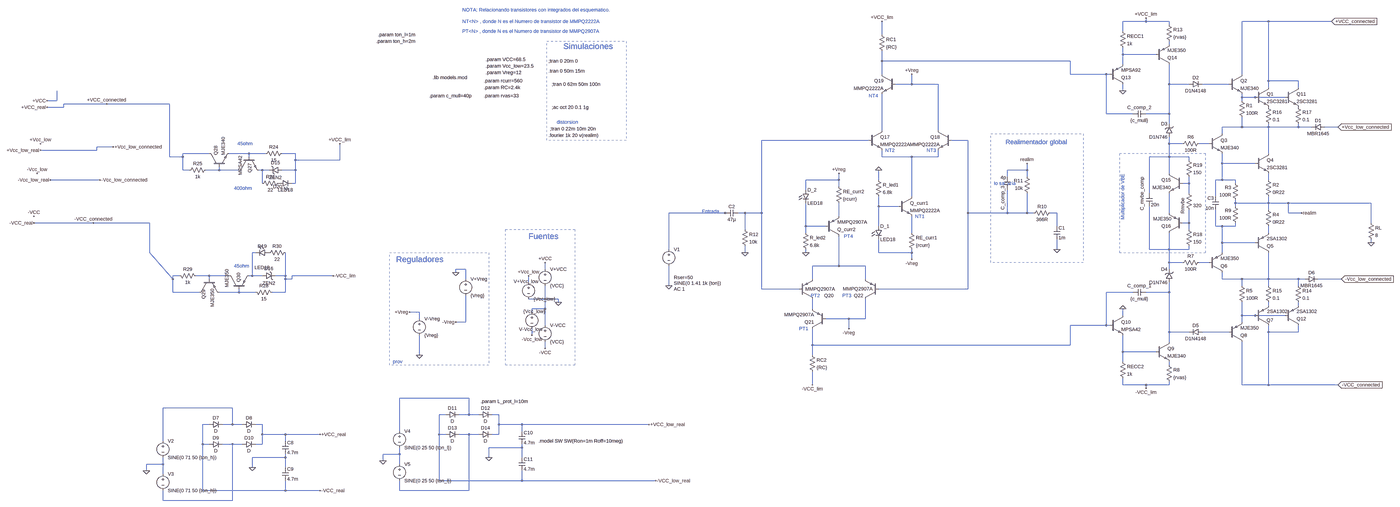
[diagram p0: schematic ampli-exp.asc, whole sheet]
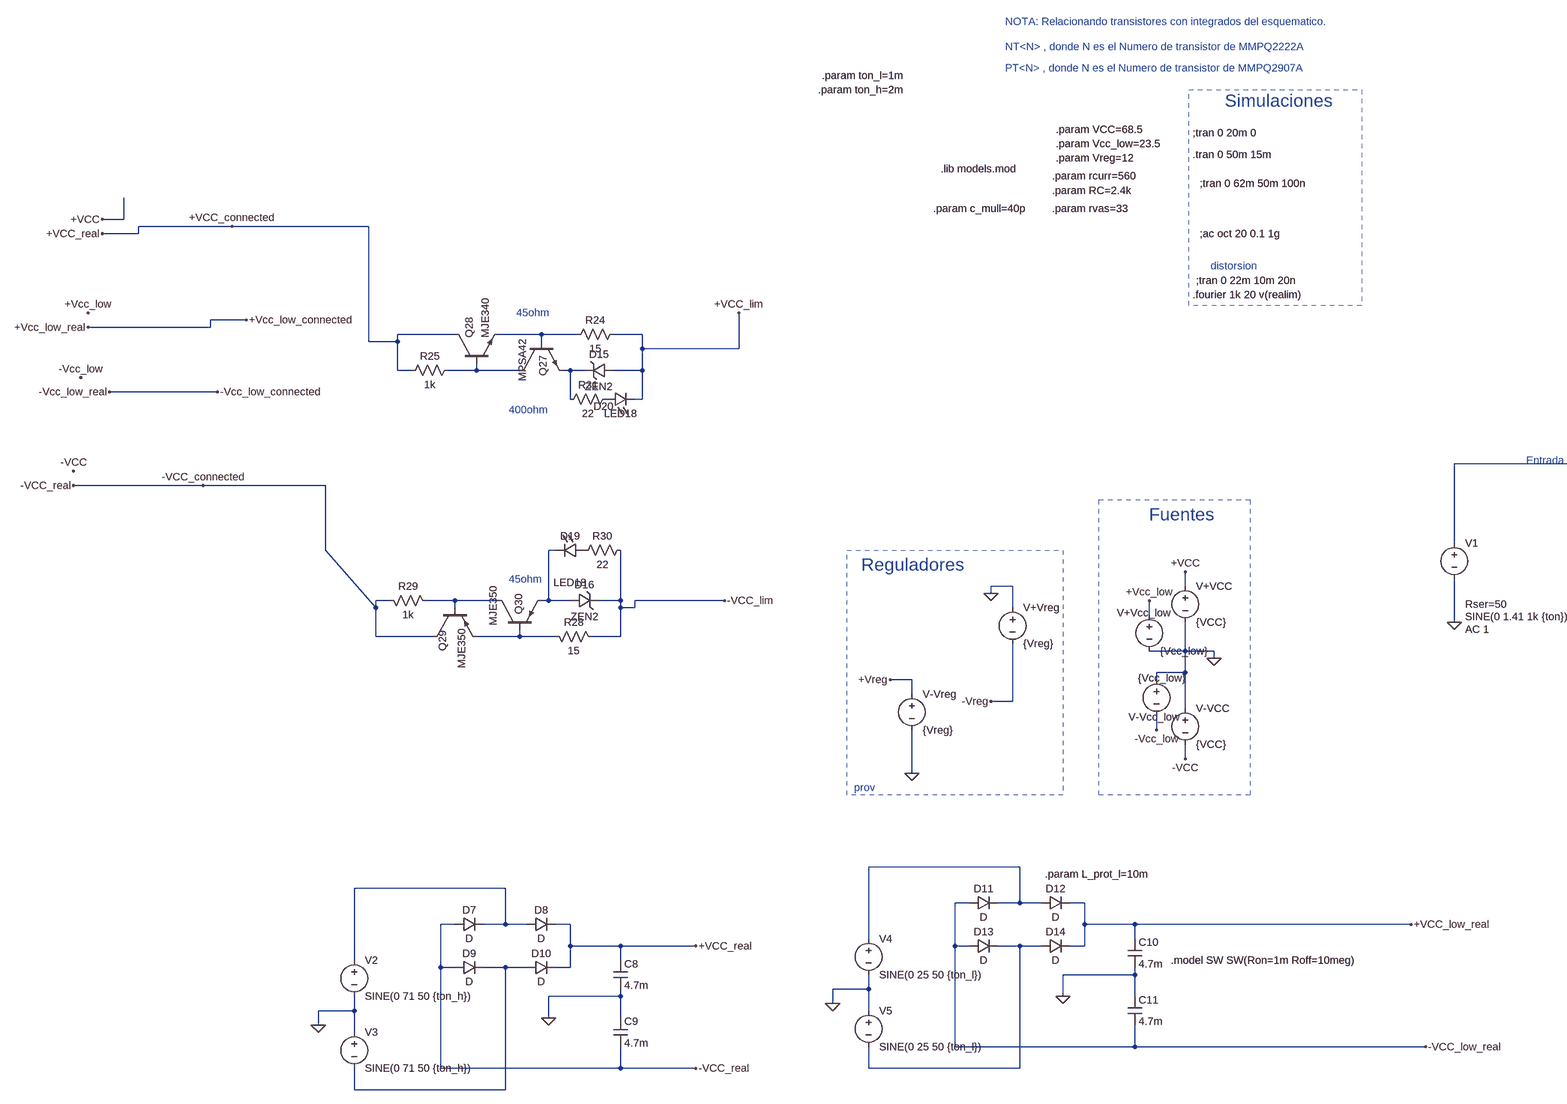
[diagram p1: schematic ampli-exp.asc, part, row 1 of 1, column 1 of 2]
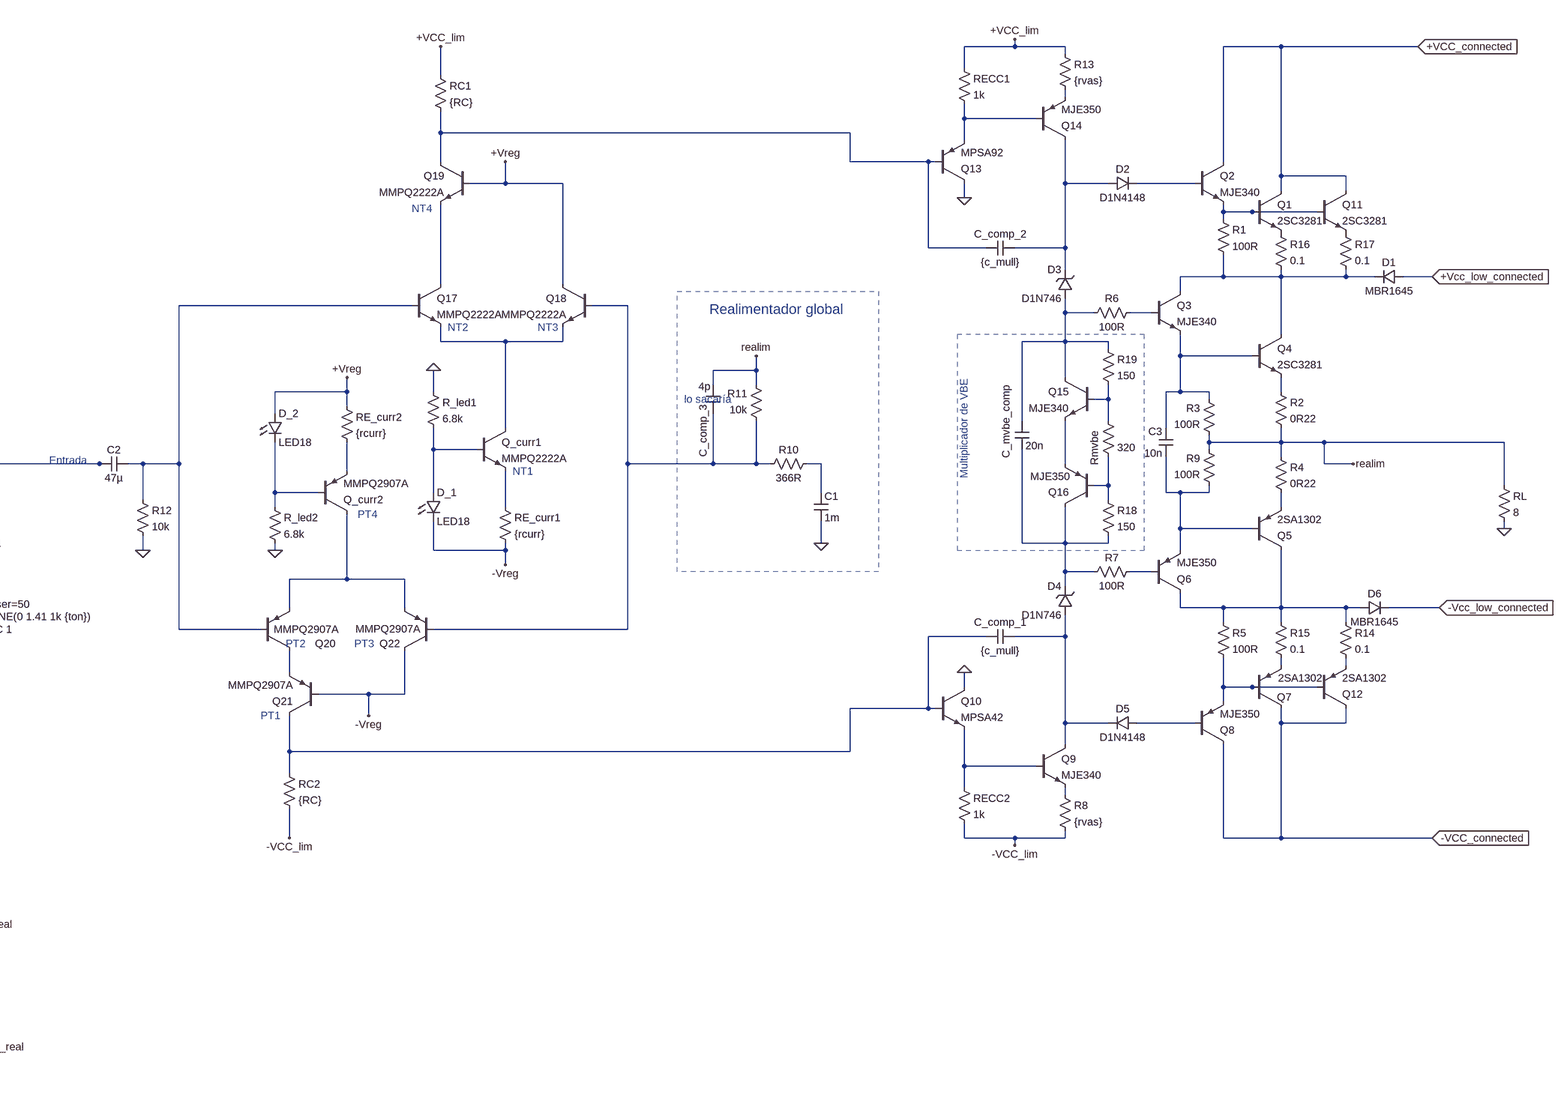
[diagram p2: schematic ampli-exp.asc, part, row 1 of 1, column 2 of 2]
ampli-exp.asc, the LTspice schematic file:
Version 4
SHEET 1 6132 2164
WIRE 1792 -752 1792 -768
WIRE 1792 -752 1680 -752
WIRE 1904 -752 1792 -752
WIRE 2384 -752 2256 -752
WIRE 2688 -752 2384 -752
WIRE 1904 -736 1904 -752
WIRE 1680 -704 1680 -752
WIRE 464 -688 464 -752
WIRE 1904 -640 1904 -656
WIRE 1680 -592 1680 -624
WIRE 1840 -592 1680 -592
WIRE 464 -560 464 -608
WIRE 1392 -560 464 -560
WIRE 1680 -544 1680 -592
WIRE 464 -496 464 -560
WIRE 1392 -496 1392 -560
WIRE 1600 -496 1392 -496
WIRE 1616 -496 1600 -496
WIRE 2256 -496 2256 -752
WIRE 2384 -464 2384 -752
WIRE 2528 -464 2384 -464
WIRE 608 -448 608 -496
WIRE 608 -448 528 -448
WIRE 736 -448 608 -448
WIRE 1904 -448 1904 -544
WIRE 2000 -448 1904 -448
WIRE 2192 -448 2064 -448
WIRE 2384 -432 2384 -464
WIRE 2528 -432 2528 -464
WIRE 1680 -416 1680 -448
WIRE 2256 -384 2256 -400
WIRE 2320 -384 2256 -384
WIRE 2464 -384 2320 -384
WIRE -3600 -368 -3600 -416
WIRE -3600 -368 -3648 -368
WIRE 2256 -368 2256 -384
WIRE -3360 -352 -3568 -352
WIRE -3056 -352 -3360 -352
WIRE -3568 -336 -3568 -352
WIRE -3568 -336 -3648 -336
WIRE 1600 -304 1600 -496
WIRE 1728 -304 1600 -304
WIRE 1904 -304 1904 -448
WIRE 1904 -304 1792 -304
WIRE 1904 -256 1904 -304
WIRE 2256 -240 2256 -288
WIRE 2256 -240 2160 -240
WIRE 2384 -240 2384 -256
WIRE 2384 -240 2256 -240
WIRE 2528 -240 2528 -256
WIRE 2528 -240 2384 -240
WIRE 2592 -240 2528 -240
WIRE 2720 -240 2656 -240
WIRE 464 -224 464 -400
WIRE 736 -224 736 -448
WIRE 2160 -208 2160 -240
WIRE 400 -176 -128 -176
WIRE 880 -176 800 -176
WIRE 1904 -160 1904 -192
WIRE 1968 -160 1904 -160
WIRE 2096 -160 2048 -160
WIRE -3328 -144 -3408 -144
WIRE -3408 -128 -3408 -144
WIRE -3408 -128 -3680 -128
WIRE -2864 -112 -2992 -112
WIRE -2672 -112 -2768 -112
WIRE -2592 -112 -2672 -112
WIRE -2448 -112 -2512 -112
WIRE 2384 -112 2384 -240
WIRE -3056 -96 -3056 -352
WIRE -2992 -96 -2992 -112
WIRE -2992 -96 -3056 -96
WIRE -2672 -96 -2672 -112
WIRE 464 -96 464 -128
WIRE 608 -96 464 -96
WIRE 736 -96 736 -128
WIRE 736 -96 608 -96
WIRE 1904 -96 1904 -160
WIRE 1904 -96 1808 -96
WIRE 2000 -96 1904 -96
WIRE -2448 -80 -2448 -112
WIRE -2208 -80 -2208 -160
WIRE -2208 -80 -2448 -80
WIRE 2000 -80 2000 -96
WIRE 2160 -64 2160 -112
WIRE 2320 -64 2160 -64
WIRE -2992 -32 -2992 -96
WIRE -2960 -32 -2992 -32
WIRE -2816 -32 -2816 -48
WIRE -2816 -32 -2880 -32
WIRE -2720 -32 -2816 -32
WIRE -2608 -32 -2624 -32
WIRE -2576 -32 -2608 -32
WIRE -2448 -32 -2448 -80
WIRE -2448 -32 -2512 -32
WIRE 1184 -32 1184 -64
WIRE 1184 -32 1088 -32
WIRE 1904 -16 1904 -96
WIRE 1088 0 1088 -32
WIRE 1184 0 1184 -32
WIRE -3392 16 -3632 16
WIRE 256 16 256 -16
WIRE 256 16 96 16
WIRE 448 16 448 -32
WIRE 2160 16 2160 -64
WIRE 2160 16 2128 16
WIRE 2224 16 2160 16
WIRE 2384 16 2384 -16
WIRE -2608 32 -2608 -32
WIRE -2448 32 -2448 -32
WIRE -2448 32 -2464 32
WIRE 2000 32 2000 0
WIRE 2000 32 1968 32
WIRE 2224 32 2224 16
WIRE 256 48 256 16
WIRE 96 64 96 16
WIRE 1808 80 1808 -96
WIRE 2000 80 2000 32
WIRE 608 96 608 -96
WIRE 2128 96 2128 16
WIRE 2224 128 2224 112
WIRE 2384 128 2384 96
WIRE 2384 128 2224 128
WIRE 2480 128 2384 128
WIRE 2880 128 2480 128
WIRE 448 144 448 96
WIRE 544 144 448 144
WIRE 2224 144 2224 128
WIRE 2384 160 2384 128
WIRE -304 176 -576 176
WIRE -288 176 -304 176
WIRE -208 176 -240 176
WIRE -128 176 -128 -176
WIRE -128 176 -208 176
WIRE 880 176 880 -176
WIRE 1088 176 1088 64
WIRE 1088 176 880 176
WIRE 1184 176 1184 80
WIRE 1184 176 1088 176
WIRE 1216 176 1184 176
WIRE 1328 176 1296 176
WIRE 1904 176 1904 80
WIRE 2480 176 2480 128
WIRE 2544 176 2480 176
WIRE 256 192 256 128
WIRE -3424 224 -3712 224
WIRE -3152 224 -3424 224
WIRE 2000 224 2000 160
WIRE 2000 224 1968 224
WIRE 2880 224 2880 128
WIRE 96 240 96 128
WIRE 192 240 96 240
WIRE 448 240 448 144
WIRE 1328 240 1328 176
WIRE 2128 240 2128 160
WIRE 2160 240 2128 240
WIRE 2224 240 2224 224
WIRE 2224 240 2160 240
WIRE -208 256 -208 176
WIRE 2000 256 2000 224
WIRE 96 272 96 240
WIRE 608 272 608 192
WIRE 2384 272 2384 240
WIRE 2160 320 2160 240
WIRE 2320 320 2160 320
WIRE 2880 320 2880 304
WIRE -576 352 -576 176
WIRE 1328 352 1328 304
WIRE 1808 352 1808 144
WIRE 1904 352 1904 272
WIRE 1904 352 1808 352
WIRE 2000 352 2000 336
WIRE 2000 352 1904 352
WIRE -3152 368 -3152 224
WIRE -2640 368 -2656 368
WIRE -208 368 -208 336
WIRE 96 368 96 352
WIRE 448 368 448 304
WIRE 608 368 608 352
WIRE 608 368 448 368
WIRE 2160 368 2160 320
WIRE 608 400 608 368
WIRE 1904 416 1904 352
WIRE 1968 416 1904 416
WIRE 2096 416 2048 416
WIRE 256 432 256 288
WIRE 256 432 128 432
WIRE 384 432 256 432
WIRE -1568 448 -1616 448
WIRE -1184 448 -1184 416
WIRE 1904 448 1904 416
WIRE -1616 464 -1616 448
WIRE -3008 480 -3040 480
WIRE -2864 480 -2928 480
WIRE -2768 480 -2864 480
WIRE -2656 480 -2656 368
WIRE -2656 480 -2672 480
WIRE -2608 480 -2656 480
WIRE -2496 480 -2496 368
WIRE -2496 480 -2544 480
WIRE -2240 480 -2464 480
WIRE -3040 496 -3152 368
WIRE -3040 496 -3040 480
WIRE -2864 496 -2864 480
WIRE -2496 496 -2496 480
WIRE -2464 496 -2464 480
WIRE -2464 496 -2496 496
WIRE -1568 496 -1568 448
WIRE 128 496 128 432
WIRE 384 496 384 432
WIRE 2160 496 2160 464
WIRE 2256 496 2160 496
WIRE 2304 496 2256 496
WIRE 2384 496 2384 368
WIRE 2384 496 2304 496
WIRE 2528 496 2384 496
WIRE 2560 496 2528 496
WIRE 2736 496 2624 496
WIRE -1264 512 -1264 480
WIRE -576 528 -576 432
WIRE 2256 528 2256 496
WIRE 2384 528 2384 496
WIRE 2528 528 2528 496
WIRE -128 544 -128 176
WIRE 64 544 -128 544
WIRE 880 544 880 176
WIRE 880 544 448 544
WIRE -3040 560 -3040 496
WIRE -2912 560 -3040 560
WIRE -2720 560 -2720 544
WIRE -2720 560 -2816 560
WIRE -2640 560 -2720 560
WIRE -2496 560 -2496 496
WIRE -2496 560 -2560 560
WIRE 1728 560 1600 560
WIRE 1904 560 1904 512
WIRE 1904 560 1792 560
WIRE -1184 592 -1184 528
WIRE -1184 592 -1264 592
WIRE -1120 592 -1184 592
WIRE -1120 608 -1120 592
WIRE 2384 624 2384 608
WIRE 2528 624 2528 608
WIRE -1184 640 -1184 592
WIRE -1184 640 -1248 640
WIRE 128 640 128 592
WIRE -1792 656 -1840 656
WIRE -1248 656 -1248 640
WIRE 1680 672 1680 640
WIRE 2256 672 2256 608
WIRE 2320 672 2256 672
WIRE 2464 672 2320 672
WIRE -1792 688 -1792 656
WIRE 304 688 192 688
WIRE 384 688 384 592
WIRE 384 688 304 688
WIRE -1568 704 -1568 576
WIRE -1568 704 -1616 704
WIRE 2256 704 2256 672
WIRE -1184 720 -1184 640
WIRE 1600 720 1600 560
WIRE 1600 720 1392 720
WIRE 1616 720 1600 720
WIRE 304 736 304 688
WIRE 1904 752 1904 560
WIRE 2000 752 1904 752
WIRE 2192 752 2064 752
WIRE 2384 752 2384 720
WIRE 2528 752 2528 720
WIRE 2528 752 2384 752
WIRE -1248 768 -1248 736
WIRE 1904 800 1904 752
WIRE 128 816 128 736
WIRE 1392 816 1392 720
WIRE 1392 816 128 816
WIRE -1184 832 -1184 800
WIRE 1680 848 1680 768
WIRE 1840 848 1680 848
WIRE -1792 864 -1792 768
WIRE 128 864 128 816
WIRE 1680 896 1680 848
WIRE 1904 912 1904 896
WIRE 128 1008 128 944
WIRE 1680 1008 1680 976
WIRE 1792 1008 1680 1008
WIRE 1904 1008 1904 992
WIRE 1904 1008 1792 1008
WIRE 2256 1008 2256 800
WIRE 2384 1008 2384 752
WIRE 2384 1008 2256 1008
WIRE 2720 1008 2384 1008
WIRE 1792 1024 1792 1008
WIRE -1552 1072 -1888 1072
WIRE -2752 1120 -3088 1120
WIRE -1664 1152 -1696 1152
WIRE -1552 1152 -1552 1072
WIRE -1552 1152 -1600 1152
WIRE -1504 1152 -1552 1152
WIRE -1408 1152 -1440 1152
WIRE -2864 1200 -2896 1200
WIRE -2752 1200 -2752 1120
WIRE -2752 1200 -2800 1200
WIRE -2704 1200 -2752 1200
WIRE -2608 1200 -2640 1200
WIRE -1408 1200 -1408 1152
WIRE -1296 1200 -1408 1200
WIRE -672 1200 -1296 1200
WIRE -1888 1232 -1888 1072
WIRE -1296 1232 -1296 1200
WIRE -2608 1248 -2608 1200
WIRE -2496 1248 -2608 1248
WIRE -2304 1248 -2496 1248
WIRE -1696 1248 -1696 1152
WIRE -1664 1248 -1696 1248
WIRE -1552 1248 -1600 1248
WIRE -1504 1248 -1552 1248
WIRE -1408 1248 -1408 1200
WIRE -1408 1248 -1440 1248
WIRE -3088 1280 -3088 1120
WIRE -2496 1280 -2496 1248
WIRE -2896 1296 -2896 1200
WIRE -2864 1296 -2896 1296
WIRE -2752 1296 -2800 1296
WIRE -2704 1296 -2752 1296
WIRE -2608 1296 -2608 1248
WIRE -2608 1296 -2640 1296
WIRE -1296 1312 -1296 1296
WIRE -1296 1312 -1456 1312
WIRE -1888 1344 -1888 1312
WIRE -1888 1344 -1968 1344
WIRE -2496 1360 -2496 1344
WIRE -2496 1360 -2656 1360
WIRE -1456 1360 -1456 1312
WIRE -1296 1360 -1296 1312
WIRE -1968 1376 -1968 1344
WIRE -3088 1392 -3088 1360
WIRE -3088 1392 -3168 1392
WIRE -1888 1392 -1888 1344
WIRE -2656 1408 -2656 1360
WIRE -2496 1408 -2496 1360
WIRE -3168 1424 -3168 1392
WIRE -3088 1440 -3088 1392
WIRE -1696 1472 -1696 1248
WIRE -1296 1472 -1296 1424
WIRE -1296 1472 -1696 1472
WIRE -640 1472 -1296 1472
WIRE -2896 1520 -2896 1296
WIRE -2496 1520 -2496 1472
WIRE -2496 1520 -2896 1520
WIRE -2304 1520 -2496 1520
WIRE -1888 1520 -1888 1472
WIRE -1552 1520 -1552 1248
WIRE -1552 1520 -1888 1520
WIRE -3088 1568 -3088 1520
WIRE -2752 1568 -2752 1296
WIRE -2752 1568 -3088 1568
FLAG -1120 608 0
FLAG -1184 416 +VCC
FLAG -1264 480 +Vcc_low
FLAG -1248 768 -Vcc_low
FLAG -1184 832 -VCC
FLAG 2720 1008 -VCC_connected
IOPIN 2720 1008 In
FLAG 2736 496 -Vcc_low_connected
IOPIN 2736 496 In
FLAG 2688 -752 +VCC_connected
IOPIN 2688 -752 In
FLAG 2720 -240 +Vcc_low_connected
IOPIN 2720 -240 In
FLAG 1184 -64 realim
FLAG 2544 176 realim
FLAG -208 368 0
FLAG 1680 -416 0
FLAG 1680 640 0
FLAG -1840 656 +Vreg
FLAG -1616 704 -Vreg
FLAG 608 -496 +Vreg
FLAG 608 400 -Vreg
FLAG 256 -16 +Vreg
FLAG 304 736 -Vreg
FLAG 96 368 0
FLAG 448 -32 0
FLAG 1328 352 0
FLAG 2880 320 0
FLAG -576 528 0
FLAG -1792 864 0
FLAG -1616 464 0
FLAG -3168 1424 0
FLAG -2656 1408 0
FLAG -2304 1248 +VCC_real
FLAG -2304 1520 -VCC_real
FLAG -1968 1376 0
FLAG -1456 1360 0
FLAG -672 1200 +VCC_low_real
FLAG -3360 -352 +VCC_connected
FLAG -3424 224 -VCC_connected
FLAG -3648 -368 +VCC
FLAG -3648 -336 +VCC_real
FLAG -3680 -160 +Vcc_low
FLAG -3680 -128 +Vcc_low_real
FLAG -3328 -144 +Vcc_low_connected
FLAG -3392 16 -Vcc_low_connected
FLAG -3696 -16 -Vcc_low
FLAG -3632 16 -Vcc_low_real
FLAG -3712 192 -VCC
FLAG -3712 224 -VCC_real
FLAG -640 1472 -VCC_low_real
FLAG 464 -752 +VCC_lim
FLAG 128 1008 -VCC_lim
FLAG 1792 -768 +VCC_lim
FLAG 1792 1024 -VCC_lim
FLAG -2208 -160 +VCC_lim
FLAG -2240 480 -VCC_lim
DATAFLAG 2304 496 "round($*100)/100"
SYMBOL voltage -1248 640 R0
WINDOW 0 -62 99 Left 2
WINDOW 3 -41 12 Left 2
WINDOW 123 0 0 Left 2
WINDOW 39 0 0 Left 2
SYMATTR InstName V-Vcc_low
SYMATTR Value {Vcc_low}
SYMBOL voltage -1184 432 R0
WINDOW 123 0 0 Left 2
WINDOW 39 0 0 Left 2
SYMATTR InstName V+VCC
SYMATTR Value {VCC}
SYMBOL voltage -1264 496 R0
WINDOW 0 -72 11 Left 2
WINDOW 123 0 0 Left 2
WINDOW 39 0 0 Left 2
SYMATTR InstName V+Vcc_low
SYMATTR Value {Vcc_low}
SYMBOL voltage -1184 704 R0
WINDOW 123 0 0 Left 2
WINDOW 39 0 0 Left 2
SYMATTR InstName V-VCC
SYMATTR Value {VCC}
SYMBOL npn 2320 -432 R0
SYMATTR InstName Q1
SYMATTR Value 2SC3281
SYMBOL npn 2192 -496 R0
SYMATTR InstName Q2
SYMATTR Value MJE340
SYMBOL res 2240 -384 R0
SYMATTR InstName R1
SYMATTR Value 100R
SYMBOL diode 2656 -224 M270
WINDOW 0 32 32 VTop 2
WINDOW 3 0 32 VBottom 2
SYMATTR InstName D1
SYMATTR Value MBR1645
SYMBOL diode 2000 -432 R270
WINDOW 0 32 32 VTop 2
WINDOW 3 0 32 VBottom 2
SYMATTR InstName D2
SYMATTR Value D1N4148
SYMBOL zener 1920 -192 R180
WINDOW 0 24 64 Left 2
WINDOW 3 24 0 Left 2
SYMATTR InstName D3
SYMATTR Value D1N746
SYMBOL npn 2096 -208 R0
SYMATTR InstName Q3
SYMATTR Value MJE340
SYMBOL npn 2320 -112 R0
SYMATTR InstName Q4
SYMATTR Value 2SC3281
SYMBOL res 2368 0 R0
SYMATTR InstName R2
SYMATTR Value 0R22
SYMBOL res 2240 128 R180
WINDOW 0 36 76 Left 2
WINDOW 3 36 40 Left 2
SYMATTR InstName R3
SYMATTR Value 100R
SYMBOL res 2368 144 R0
SYMATTR InstName R4
SYMATTR Value 0R22
SYMBOL pnp 2320 368 M180
SYMATTR InstName Q5
SYMATTR Value 2SA1302
SYMBOL pnp 2096 464 M180
SYMATTR InstName Q6
SYMATTR Value MJE350
SYMBOL pnp 2320 720 M180
WINDOW 0 55 25 Left 2
WINDOW 3 57 68 Left 2
SYMATTR InstName Q7
SYMATTR Value 2SA1302
SYMBOL pnp 2192 800 M180
SYMATTR InstName Q8
SYMATTR Value MJE350
SYMBOL res 2240 512 R0
SYMATTR InstName R5
SYMATTR Value 100R
SYMBOL zener 1920 512 R180
WINDOW 0 24 64 Left 2
WINDOW 3 24 0 Left 2
SYMATTR InstName D4
SYMATTR Value D1N746
SYMBOL diode 2064 736 R90
WINDOW 0 0 32 VBottom 2
WINDOW 3 32 32 VTop 2
SYMATTR InstName D5
SYMATTR Value D1N4148
SYMBOL diode 2560 512 R270
WINDOW 0 32 32 VTop 2
WINDOW 3 0 32 VBottom 2
SYMATTR InstName D6
SYMATTR Value MBR1645
SYMBOL res 2064 -176 R90
WINDOW 0 0 56 VBottom 2
WINDOW 3 32 56 VTop 2
SYMATTR InstName R6
SYMATTR Value 100R
SYMBOL res 2064 400 R90
WINDOW 0 0 56 VBottom 2
WINDOW 3 32 56 VTop 2
SYMATTR InstName R7
SYMATTR Value 100R
SYMBOL npn 1840 800 R0
SYMATTR InstName Q9
SYMATTR Value MJE340
SYMBOL res 1888 896 R0
SYMATTR InstName R8
SYMATTR Value {rvas}
SYMBOL npn 1616 672 R0
SYMATTR InstName Q10
SYMATTR Value MPSA42
SYMBOL res 2240 240 R180
WINDOW 0 36 76 Left 2
WINDOW 3 36 40 Left 2
SYMATTR InstName R9
SYMATTR Value 100R
SYMBOL res 1200 192 R270
WINDOW 0 32 56 VTop 2
WINDOW 3 0 56 VBottom 2
SYMATTR InstName R10
SYMATTR Value 366R
SYMBOL res 1200 96 R180
WINDOW 0 36 76 Left 2
WINDOW 3 36 40 Left 2
SYMATTR InstName R11
SYMATTR Value 10k
SYMBOL res -224 240 R0
SYMATTR InstName R12
SYMATTR Value 10k
SYMBOL cap 1312 240 R0
SYMATTR InstName C1
SYMATTR Value 1m
SYMBOL cap -240 160 R90
WINDOW 0 0 32 VBottom 2
WINDOW 3 32 32 VTop 2
SYMATTR InstName C2
SYMATTR Value 47µ
SYMBOL cap 1792 544 R90
WINDOW 0 0 32 VBottom 2
WINDOW 3 32 32 VTop 2
SYMATTR InstName C_comp_1
SYMATTR Value {c_mull}
SYMBOL cap 2144 160 R180
WINDOW 0 24 56 Left 2
WINDOW 3 24 8 Left 2
SYMATTR InstName C3
SYMATTR Value 10n
SYMBOL npn 2464 -432 R0
SYMATTR InstName Q11
SYMATTR Value 2SC3281
SYMBOL pnp 2464 720 M180
SYMATTR InstName Q12
SYMATTR Value 2SA1302
SYMBOL pnp 1616 -448 M180
SYMATTR InstName Q13
SYMATTR Value MPSA92
SYMBOL pnp 1840 -544 M180
SYMATTR InstName Q14
SYMATTR Value MJE350
SYMBOL cap 1792 -320 R90
WINDOW 0 0 32 VBottom 2
WINDOW 3 32 32 VTop 2
SYMATTR InstName C_comp_2
SYMATTR Value {c_mull}
SYMBOL res 1888 -752 R0
SYMATTR InstName R13
SYMATTR Value {rvas}
SYMBOL res 2512 512 R0
SYMATTR InstName R14
SYMATTR Value 0.1
SYMBOL res 2368 512 R0
SYMATTR InstName R15
SYMATTR Value 0.1
SYMBOL res 2368 -352 R0
SYMATTR InstName R16
SYMATTR Value 0.1
SYMBOL res 2512 -352 R0
SYMATTR InstName R17
SYMATTR Value 0.1
SYMBOL cap 1104 64 R180
WINDOW 0 38 20 VLeft 2
WINDOW 3 21 60 Left 2
SYMATTR InstName C_comp_3
SYMATTR Value 4p
SYMBOL npn 1968 -16 M0
SYMATTR InstName Q15
SYMATTR Value MJE340
SYMBOL pnp 1968 272 R180
WINDOW 0 56 33 Left 2
WINDOW 3 53 68 Left 2
SYMATTR InstName Q16
SYMATTR Value MJE350
SYMBOL res 1984 64 R0
WINDOW 0 -14 116 VLeft 2
SYMATTR InstName Rmvbe
SYMATTR Value 320
SYMBOL res 1984 240 R0
SYMATTR InstName R18
SYMATTR Value 150
SYMBOL cap 1792 80 R0
WINDOW 0 -19 83 VLeft 2
SYMATTR InstName C_mvbe_comp
SYMATTR Value 20n
SYMBOL res 1984 -96 R0
SYMATTR InstName R19
SYMATTR Value 150
SYMBOL voltage -1568 480 R0
WINDOW 123 0 0 Left 2
WINDOW 39 0 0 Left 2
SYMATTR InstName V+Vreg
SYMATTR Value {Vreg}
SYMBOL npn 544 96 R0
SYMATTR InstName Q_curr1
SYMATTR Value MMPQ2222A
SYMBOL npn 400 -224 R0
SYMATTR InstName Q17
SYMATTR Value MMPQ2222A
SYMBOL npn 800 -224 M0
SYMATTR InstName Q18
SYMATTR Value MMPQ2222A
SYMBOL res 432 0 R0
SYMATTR InstName R_led1
SYMATTR Value 6.8k
SYMBOL res 592 256 R0
SYMATTR InstName RE_curr1
SYMATTR Value {rcurr}
SYMBOL LED 432 240 R0
SYMATTR InstName D_1
SYMATTR Value LED18
SYMBOL res 448 -704 R0
SYMATTR InstName RC1
SYMATTR Value {RC}
SYMBOL npn 528 -496 M0
SYMATTR InstName Q19
SYMATTR Value MMPQ2222A
SYMBOL res 240 32 R0
SYMATTR InstName RE_curr2
SYMATTR Value {rcurr}
SYMBOL pnp 192 288 M180
SYMATTR InstName Q_curr2
SYMATTR Value MMPQ2907A
SYMBOL pnp 64 592 M180
WINDOW 0 121 16 Left 2
WINDOW 3 29 48 Left 2
SYMATTR InstName Q20
SYMATTR Value MMPQ2907A
SYMBOL pnp 192 736 R180
SYMATTR InstName Q21
SYMATTR Value MMPQ2907A
SYMBOL res 112 848 R0
SYMATTR InstName RC2
SYMATTR Value {RC}
SYMBOL pnp 448 592 R180
WINDOW 0 74 16 Left 2
WINDOW 3 28 49 Left 2
SYMATTR InstName Q22
SYMATTR Value MMPQ2907A
SYMBOL LED 80 64 R0
SYMATTR InstName D_2
SYMATTR Value LED18
SYMBOL res 80 256 R0
SYMATTR InstName R_led2
SYMATTR Value 6.8k
SYMBOL res 1664 880 R0
SYMATTR InstName RECC2
SYMATTR Value 1k
SYMBOL res 1664 -720 R0
SYMATTR InstName RECC1
SYMATTR Value 1k
SYMBOL voltage -576 336 R0
WINDOW 3 24 180 Left 2
WINDOW 123 24 208 Left 2
WINDOW 39 24 152 Left 2
SYMATTR Value SINE(0 1.41 1k {ton})
SYMATTR Value2 AC 1
SYMATTR SpiceLine Rser=50
SYMATTR InstName V1
SYMBOL res 2864 208 R0
SYMATTR InstName RL
SYMATTR Value 8
SYMBOL voltage -1792 672 R0
WINDOW 123 0 0 Left 2
WINDOW 39 0 0 Left 2
SYMATTR InstName V-Vreg
SYMATTR Value {Vreg}
SYMBOL voltage -3088 1264 R0
WINDOW 123 0 0 Left 2
WINDOW 39 0 0 Left 2
SYMATTR InstName V2
SYMATTR Value SINE(0 71 50 {ton_h})
SYMBOL diode -2864 1216 R270
WINDOW 0 32 32 VTop 2
WINDOW 3 0 32 VBottom 2
SYMATTR InstName D7
SYMBOL diode -2704 1216 R270
WINDOW 0 32 32 VTop 2
WINDOW 3 0 32 VBottom 2
SYMATTR InstName D8
SYMBOL diode -2864 1312 R270
WINDOW 0 32 32 VTop 2
WINDOW 3 0 32 VBottom 2
SYMATTR InstName D9
SYMBOL diode -2704 1312 R270
WINDOW 0 32 32 VTop 2
WINDOW 3 0 32 VBottom 2
SYMATTR InstName D10
SYMBOL cap -2512 1280 R0
SYMATTR InstName C8
SYMATTR Value 4.7m
SYMBOL voltage -3088 1424 R0
WINDOW 123 0 0 Left 2
WINDOW 39 0 0 Left 2
SYMATTR InstName V3
SYMATTR Value SINE(0 71 50 {ton_h})
SYMBOL cap -2512 1408 R0
SYMATTR InstName C9
SYMATTR Value 4.7m
SYMBOL voltage -1888 1216 R0
WINDOW 123 0 0 Left 2
WINDOW 39 0 0 Left 2
SYMATTR InstName V4
SYMATTR Value SINE(0 25 50 {ton_l})
SYMBOL diode -1664 1168 R270
WINDOW 0 32 32 VTop 2
WINDOW 3 0 32 VBottom 2
SYMATTR InstName D11
SYMBOL diode -1504 1168 R270
WINDOW 0 32 32 VTop 2
WINDOW 3 0 32 VBottom 2
SYMATTR InstName D12
SYMBOL diode -1664 1264 R270
WINDOW 0 32 32 VTop 2
WINDOW 3 0 32 VBottom 2
SYMATTR InstName D13
SYMBOL diode -1504 1264 R270
WINDOW 0 32 32 VTop 2
WINDOW 3 0 32 VBottom 2
SYMATTR InstName D14
SYMBOL cap -1312 1232 R0
SYMATTR InstName C10
SYMATTR Value 4.7m
SYMBOL voltage -1888 1376 R0
WINDOW 123 0 0 Left 2
WINDOW 39 0 0 Left 2
SYMATTR InstName V5
SYMATTR Value SINE(0 25 50 {ton_l})
SYMBOL cap -1312 1360 R0
SYMATTR InstName C11
SYMATTR Value 4.7m
SYMBOL res -2496 -128 R90
WINDOW 0 0 56 VBottom 2
WINDOW 3 32 56 VTop 2
SYMATTR InstName R24
SYMATTR Value 15
SYMBOL res -2864 -48 R90
WINDOW 0 0 56 VBottom 2
WINDOW 3 32 56 VTop 2
SYMATTR InstName R25
SYMATTR Value 1k
SYMBOL npn -2720 -96 M90
WINDOW 0 32 52 Left 2
WINDOW 3 -6 6 Left 2
SYMATTR InstName Q27
SYMATTR Value MPSA42
SYMBOL npn -2864 -48 R270
SYMATTR InstName Q28
SYMATTR Value MJE340
SYMBOL res -2544 576 M270
WINDOW 0 32 56 VTop 2
WINDOW 3 0 56 VBottom 2
SYMATTR InstName R28
SYMATTR Value 15
SYMBOL res -2912 496 M270
WINDOW 0 32 56 VTop 2
WINDOW 3 0 56 VBottom 2
SYMATTR InstName R29
SYMATTR Value 1k
SYMBOL pnp -2912 496 M90
WINDOW 0 51 21 Left 2
WINDOW 3 46 63 Left 2
SYMATTR InstName Q29
SYMATTR Value MJE350
SYMBOL pnp -2768 544 R270
WINDOW 0 33 46 Left 2
WINDOW 3 8 -11 Left 2
SYMATTR InstName Q30
SYMATTR Value MJE350
SYMBOL LED -2576 352 R90
WINDOW 0 0 32 VBottom 2
WINDOW 3 72 32 VTop 2
SYMATTR InstName D19
SYMATTR Value LED18
SYMBOL res -2480 352 R90
WINDOW 0 0 56 VBottom 2
WINDOW 3 32 56 VTop 2
SYMATTR InstName R30
SYMATTR Value 22
SYMBOL LED -2528 48 R270
WINDOW 0 -16 -6 VTop 2
WINDOW 3 0 32 VBottom 2
SYMATTR InstName D20
SYMATTR Value LED18
SYMBOL res -2512 16 R90
WINDOW 0 0 56 VBottom 2
WINDOW 3 32 56 VTop 2
SYMATTR InstName R31
SYMATTR Value 22
SYMBOL rui\\shortcuts\\zener -2512 -48 R90
WINDOW 0 -4 32 VBottom 2
WINDOW 3 36 32 VTop 2
SYMATTR InstName D15
SYMATTR Value ZEN2
SYMBOL rui\\shortcuts\\zener -2608 496 R270
WINDOW 0 36 32 VTop 2
WINDOW 3 -4 32 VBottom 2
SYMATTR InstName D16
SYMATTR Value ZEN2
TEXT -1168 -560 Left 2 !;tran 0 20m 0
TEXT -1168 -200 Left 2 !.fourier 1k 20 v(realim)
TEXT -1264 288 Left 4 ;Fuentes
TEXT -1096 -632 Left 4 ;Simulaciones
TEXT -1160 -232 Left 2 !;tran 0 22m 10m 20n
TEXT -1128 -264 Left 2 ;distorsion
TEXT -1152 -336 Left 2 !;ac oct 20 0.1 1g
TEXT -1728 -480 Left 2 !.lib models.mod
TEXT 1680 208 VLeft 2 ;Multiplicador de VBE
TEXT -1904 400 Left 4 ;Reguladores
TEXT -1920 896 Left 2 ;prov
TEXT 1080 -168 Left 3 ;Realimentador global
TEXT 480 -128 Left 2 ;NT2
TEXT 680 -128 Left 2 ;NT3
TEXT 624 192 Left 2 ;NT1
TEXT 400 -392 Left 2 ;NT4
TEXT 120 576 Left 2 ;PT2
TEXT -1584 -752 Left 2 ;NT<N> , donde N es el Numero de transistor de MMPQ2222A
TEXT -1584 -704 Left 2 ;PT<N> , donde N es el Numero de transistor de MMPQ2907A
TEXT -1584 -808 Left 2 ;NOTA: Relacionando transistores con integrados del esquematico.
TEXT 64 736 Left 2 ;PT1
TEXT 272 576 Left 2 ;PT3
TEXT 280 288 Left 2 ;PT4
TEXT -416 168 Left 2 ;Entrada
TEXT -1472 -568 Left 2 !.param VCC=68.5
TEXT -1472 -536 Left 2 !.param Vcc_low=23.5
TEXT -1472 -504 Left 2 !.param Vreg=12
TEXT -1496 1088 Left 2 !.param L_prot_l=10m
TEXT -1216 1280 Left 2 !.model SW SW(Ron=1m Roff=10meg)
TEXT -1480 -432 Left 2 !.param RC=2.4k
TEXT -1480 -392 Left 2 !.param rvas=33
TEXT -1480 -464 Left 2 !.param rcurr=560
TEXT -1168 -512 Left 2 !.tran 0 50m 15m
TEXT -1992 -688 Left 2 !.param ton_l=1m
TEXT -1152 -448 Left 2 !;tran 0 62m 50m 100n
TEXT -2744 56 Left 2 ;400ohm
TEXT -2728 -160 Left 2 ;45ohm
TEXT -2744 432 Left 2 ;45ohm
TEXT -1744 -392 Left 2 !.param c_mull=40p
TEXT 1024 32 Left 2 ;lo sacaría
TEXT -2000 -656 Left 2 !.param ton_h=2m
RECTANGLE Normal -1040 912 -1376 256 2
RECTANGLE Normal -792 -176 -1176 -656 2
RECTANGLE Normal 1664 368 2080 -112 2
RECTANGLE Normal -1456 912 -1936 368 2
RECTANGLE Normal 1456 416 1008 -208 2

The netlist it stands for:
* ampli-exp.asc
V-Vcc_low 0 -Vcc_low {Vcc_low}
V+VCC +VCC 0 {VCC}
V+Vcc_low +Vcc_low 0 {Vcc_low}
V-VCC 0 -VCC {VCC}
Q1 +VCC_real N006 P001 0 2SC3281
Q2 +VCC_real N005 N006 0 MJE340
R1 N006 N007 100R
D1 +VCC_low_real N007 MBR1645
D2 N004 N005 D1N4148
D3 N011 N004 D1N746
Q3 N007 N012 N015 0 MJE340
Q4 N007 N015 N018 0 2SC3281
R2 N018 realim 0R22
R3 realim N015 100R
R4 realim N029 0R22
Q5 N035 N027 N029 0 2SA1302
Q6 N035 N032 N027 0 MJE350
Q7 -VCC_real N042 N039 0 2SA1302
Q8 -VCC_real N043 N042 0 MJE350
R5 N035 N042 100R
D4 N038 N030 D1N746
D5 N043 N038 D1N4148
D6 N035 -Vcc_low_real MBR1645
R6 N012 N011 100R
R7 N032 N030 100R
Q9 N038 N044 N045 0 MJE340
R8 N045 -VCC_lim {rvas}
Q10 0 N037 N044 0 MPSA42
R9 N027 realim 100R
R10 N010 N022 366R
R11 N010 realim 10k
R12 N009 0 10k
C1 N022 0 1m
C2 N009 N021 47µ
C_comp_1 N038 N037 {c_mull}
C3 N027 N015 10n
Q11 +VCC_real N006 P002 0 2SC3281
Q12 -VCC_real N042 N040 0 2SA1302
Q13 0 N003 N002 0 MPSA92
Q14 N004 N002 N001 0 MJE350
C_comp_2 N004 N003 {c_mull}
R13 +VCC_lim N001 {rvas}
R14 N035 N040 0.1
R15 N035 N039 0.1
R16 P001 N007 0.1
R17 P002 N007 0.1
C_comp_3 N010 realim 4p
Q15 N011 N019 N023 0 MJE340
Q16 N030 N025 N023 0 MJE350
Rmvbe N019 N025 320
R18 N025 N030 150
C_mvbe_comp N011 N030 20n
R19 N011 N019 150
V+Vreg 0 -Vreg {Vreg}
Q_curr1 N014 N020 N028 0 MMPQ2222A
Q17 N008 N009 N014 0 MMPQ2222A
Q18 +Vreg N010 N014 0 MMPQ2222A
R_led1 0 N020 6.8k
RE_curr1 N028 -Vreg {rcurr}
D_1 N020 -Vreg LED18
RC1 +VCC_lim N003 {RC}
Q19 N003 +Vreg N008 0 MMPQ2222A
RE_curr2 +Vreg N024 {rcurr}
Q_curr2 N033 N026 N024 0 MMPQ2907A
Q20 N041 N009 N033 0 MMPQ2907A
Q21 N037 -Vreg N041 0 MMPQ2907A
RC2 N037 -VCC_lim {RC}
Q22 -Vreg N010 N033 0 MMPQ2907A
D_2 +Vreg N026 LED18
R_led2 N026 0 6.8k
RECC2 N044 -VCC_lim 1k
RECC1 +VCC_lim N002 1k
V1 N021 0 SINE(0 1.41 1k {ton}) AC 1 Rser=50
RL realim 0 8
V-Vreg +Vreg 0 {Vreg}
V2 N047 0 SINE(0 71 50 {ton_h})
D7 -VCC_real N047 D
D8 N047 +VCC_real D
D9 -VCC_real N049 D
D10 N049 +VCC_real D
C8 +VCC_real 0 4.7m
V3 0 N049 SINE(0 71 50 {ton_h})
C9 0 -VCC_real 4.7m
V4 N046 0 SINE(0 25 50 {ton_l})
D11 -Vcc_low_real N046 D
D12 N046 +VCC_low_real D
D13 -Vcc_low_real N048 D
D14 N048 +VCC_low_real D
C10 +VCC_low_real 0 4.7m
V5 0 N048 SINE(0 25 50 {ton_l})
C11 0 -Vcc_low_real 4.7m
R24 +VCC_lim N013 15
R25 N016 +VCC_real 1k
Q27 N016 N013 N017 0 MPSA42
Q28 +VCC_real N016 N013 0 MJE340
R28 -VCC_lim N036 15
R29 N034 -VCC_real 1k
Q29 -VCC_real N034 N036 0 MJE350
Q30 N034 N036 N031 0 MJE350
D19 P003 N031 LED18
R30 -VCC_lim P003 22
D20 P004 +VCC_lim LED18
R31 P004 N017 22
D15 +VCC_lim N017 ZEN2
D16 N031 -VCC_lim ZEN2
.model D D
.lib standard.dio
.model NPN NPN
.model PNP PNP
.lib standard.bjt
;tran 0 20m 0
.fourier 1k 20 v(realim)
* Fuentes
* Simulaciones
;tran 0 22m 10m 20n
* distorsion
;ac oct 20 0.1 1g
.lib models.mod
* Multiplicador de VBE
* Reguladores
* prov
* Realimentador global
* NT2
* NT3
* NT1
* NT4
* PT2
* NT<N> , donde N es el Numero de transistor de MMPQ2222A
* PT<N> , donde N es el Numero de transistor de MMPQ2907A
* NOTA: Relacionando transistores con integrados del esquematico.
* PT1
* PT3
* PT4
* Entrada
.param VCC=68.5
.param Vcc_low=23.5
.param Vreg=12
.param L_prot_l=10m
.model SW SW(Ron=1m Roff=10meg)
.param RC=2.4k
.param rvas=33
.param rcurr=560
.tran 0 50m 15m
.param ton_l=1m
;tran 0 62m 50m 100n
* 400ohm
* 45ohm
* 45ohm
.param c_mull=40p
* lo sacaría
.param ton_h=2m
.backanno
.end